# Altium schematic sheet LightSensors_Buttons_LCD.SchDoc
size A
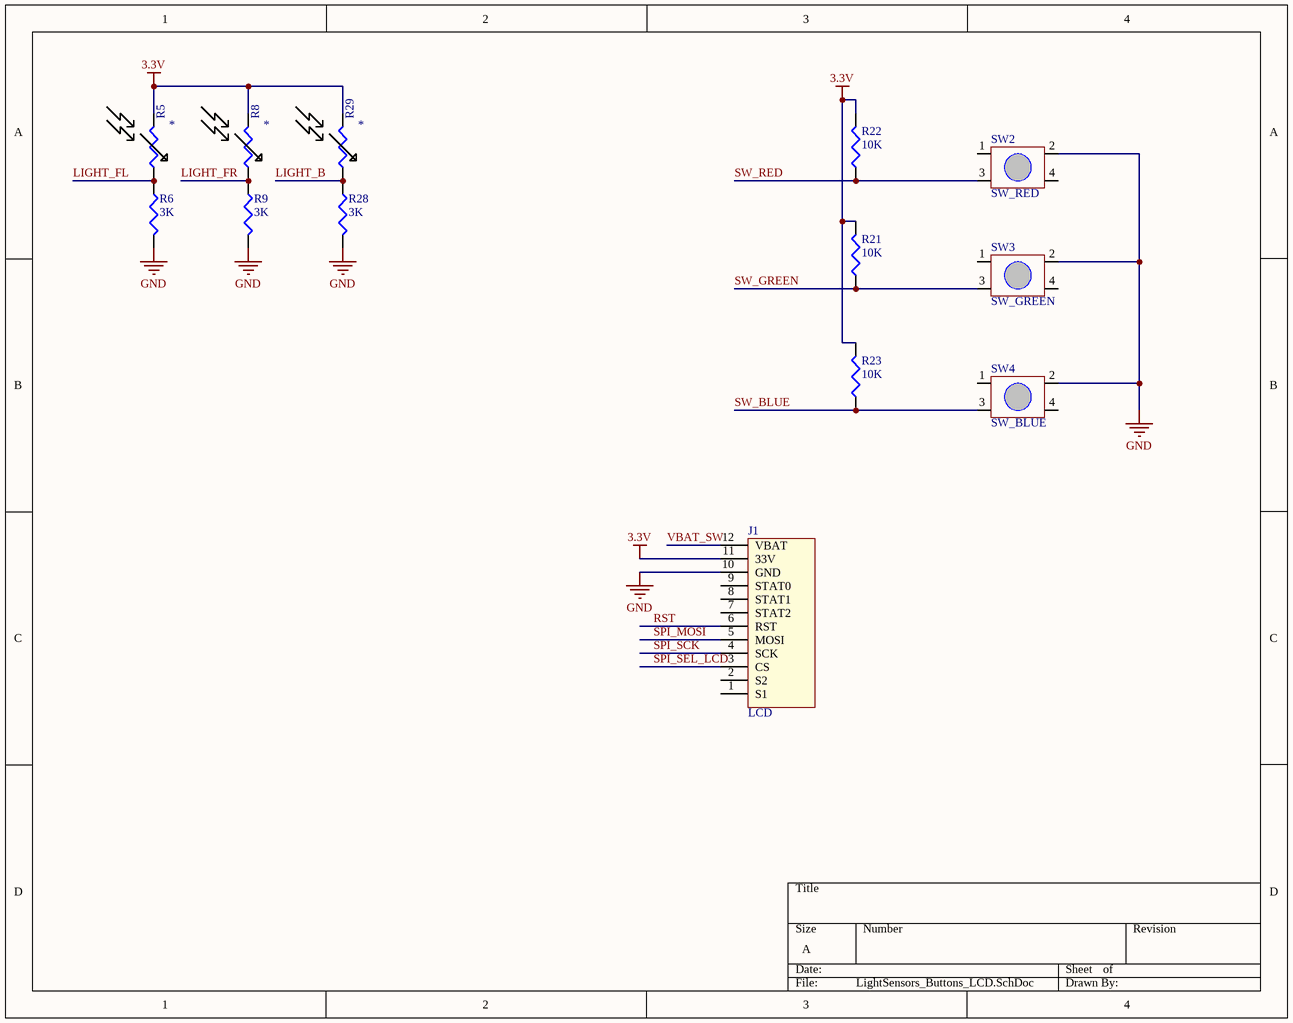
[diagram p0: LightSensors_Buttons_LCD.SchDoc]

## Parts
J1  LCD  [LCD-6100breakout]
R5  photoresistor  [photoresistor]  (value not drawn)
R6  value 3K  [RESC1608L]  (hidden comment: Res3)
R8  photoresistor  [photoresistor]  (value not drawn)
R9  value 3K  [RESC1608L]  (hidden comment: Res3)
R21  value 10K  [RESC1608L]  (hidden comment: Res3)
R22  value 10K  [RESC1608L]  (hidden comment: Res3)
R23  value 10K  [RESC1608L]  (hidden comment: Res3)
R28  value 3K  [RESC1608L]  (hidden comment: Res3)
R29  photoresistor  [photoresistor]  (value not drawn)
SW2  SW_RED  [SwitchTall-TL330]
SW3  SW_GREEN  [SwitchTall-TL330]
SW4  SW_BLUE  [SwitchTall-TL330]

## Nets
3.3V: J1.11(33V) R5.2 R8.2 R21.2 R22.2 R23.2 R29.2
GND: J1.10(GND) R6.2 R9.2 R28.2 SW2.2 SW3.2 SW4.2
LIGHT_B: R28.1 R29.1
LIGHT_FL: R5.1 R6.1
LIGHT_FR: R8.1 R9.1
RST: J1.6(RST)
SPI_MOSI: J1.5(MOSI)
SPI_SCK: J1.4(SCK)
SPI_SEL_LCD: J1.3(CS)
SW_BLUE: R23.1 SW4.3
SW_GREEN: R21.1 SW3.3
SW_RED: R22.1 SW2.3
VBAT_SW: J1.12(VBAT)

Not connected (* = marked no-connect by the designer): J1 1(S1) 2(S2) 7(STAT2) 8(STAT1) 9(STAT0); SW2 1 4; SW3 1 4; SW4 1 4

## Library data of the parts
J1 = LCD-NokiaBreakout
R6 R9 R21-R23 R28 = Res3: Resistor; Published: 8-Jun-2000; LatestRevisionDate: 29-May-2009; LatestRevisionNote: IPC-7351 Footprint Added.; PackageReference: J1-0603; Publisher: Altium Limited; PackageDescription: Chip Resistor
SW2-SW4 = Switch-TL330
R5 R8 R29 = photoresistor: Value: *